# Altium project R100.230.020.000-00 MeasInUI.PrjPcb
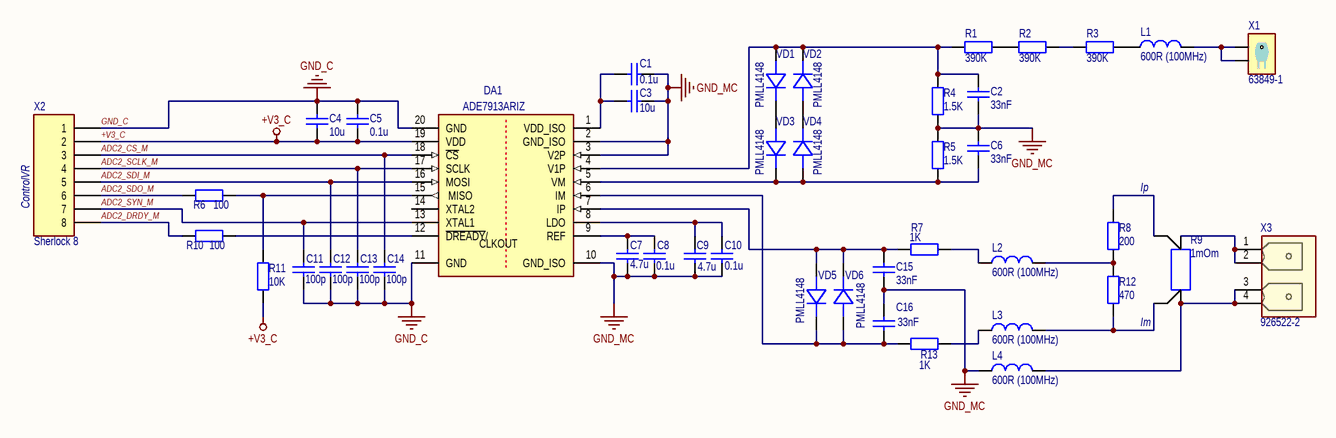
[diagram p0: MeasInUI.SchDoc]
1 sheet, 43 parts. Net scope: global (net labels, ports and power ports of the same name join across sheets).
Board file: R100.230.020.001-00 MeasInUI.PcbDoc

## Sheet MeasInUI.SchDoc
size A4; Organization: OLTEST; SheetNumber: 1; SheetTotal: 1; Название листа: Название листа; Файл: MeasConsumpBoard_v1; Разработчик: Бондарчук С.; Прибор: R100; АМАК.000000.000 Э3: R100.220.030.000 Э3; Дата: 25.12.2017; Формат: A4; WorkSpaceName: R100_Boards_v1

### Parts
C1  0.1u  [SMD_C_0603]
C2  33nF  [SMD_C_0603]
C3  10u  [SMD_C_1206]
C4  10u  [SMD_C_1206]
C5  0.1u  [SMD_C_0603]
C6  33nF  [SMD_C_0603]
C7  4.7u  [SMD_C_0805]
C8  0.1u  [SMD_C_0603]
C9  4.7u  [SMD_C_0805]
C10  0.1u  [SMD_C_0603]
C11  100p  [SMD_C_0603]
C12  100p  [SMD_C_0603]
C13  100p  [SMD_C_0603]
C14  100p  [SMD_C_0603]
C15  33nF  [SMD_C_0603]
C16  33nF  [SMD_C_0603]
DA1  ADE7913ARIZ  [SOIC-20 WidBody (RI-20-1)]
L1  600R (100MHz)  [SMD_L_1206]
L2  600R (100MHz)  [SMD_L_1206]
L3  600R (100MHz)  [SMD_L_1206]
L4  600R (100MHz)  [SMD_L_1206]
R1  390K  [SMD_R_1206]
R2  390K  [SMD_R_1206]
R3  390K  [SMD_R_1206]
R4  1.5K  [SMD_R_1206]
R5  1.5K  [SMD_R_1206]
R6  100  [SMD_R_0603]
R7  1K  [SMD_R_0805]
R8  200  [SMD_R_0805]
R9  1mOm  [WSL3637 1mOm]
R10  100  [SMD_R_0603]
R11  10K  [SMD_R_0603]
R12  470  [SMD_R_0805]
R13  1K  [SMD_R_0805]
VD1  PMLL4148  [SOD80C]
VD2  PMLL4148  [SOD80C]
VD3  PMLL4148  [SOD80C]
VD4  PMLL4148  [SOD80C]
VD5  PMLL4148  [SOD80C]
VD6  PMLL4148  [SOD80C]
X1  63849-1  [63849-1]
X2  Sherlock 8  [35362-0850]
X3  926522-2  [63849-1x2]

### Nets
+V3_C: C4.1 C5.1 DA1.19(VDD) R11.1 X2.2
GND_C: C4.2 C5.2 C11.1 C12.1 C13.1 C14.1 DA1.11(GND) DA1.20(GND) X2.1
GND_MC: C1.1 C2.1 C3.1 C6.2 C7.1 C8.2 C9.1 C10.1 C15.1 C16.2 DA1.2(GND_ISO) DA1.3(V2P) DA1.10(GND_ISO) L4.1 R4.1 R5.2
ADC2_CS_M: C14.2 DA1.18(~{CS}) X2.3
ADC2_DRDY_M: R10.1 X2.8
ADC2_SCLK_M: C13.2 DA1.17(SCLK) X2.4
ADC2_SDI_M: C12.2 DA1.16(MOSI) X2.5
ADC2_SDO_M: R6.1 X2.6
ADC2_SYN_M: C11.2 DA1.13(XTAL1) X2.7
NetC1_2: C1.2 C3.2 DA1.1(VDD_ISO)
NetC2_2: C2.2 DA1.4(V1P) R1.1 R4.2 VD1.1(ANODE) VD2.2(CATHODE)
NetC6_1: C6.1 DA1.5(VM) R5.1 VD3.2(CATHODE) VD4.1(ANODE)
NetC7_2: C7.2 C8.1 DA1.9(REF)
NetC9_2: C9.2 C10.2 DA1.8(LDO)
NetC15_2: C15.2 DA1.7(IP) R7.1 VD5.1(ANODE) VD6.2(CATHODE)
NetC16_1: C16.1 DA1.6(IM) R13.1 VD5.2(CATHODE) VD6.1(ANODE)
NetDA1_12: DA1.12(~{DREADY}/) R10.2
NetDA1_15: DA1.15(MISO) R6.2 R11.2
NetL1_1: L1.1 R3.2
NetL1_2: L1.2 X1.1 X1.2
NetL2_1: L2.1 R7.2
NetL2_2: L2.2 R8.1 R12.2
NetL3_1: L3.1 R13.2
NetL3_2: L3.2 R9.2(E1) R12.1
NetL4_2: L4.2 R9.1(I1) X3.3 X3.4
NetR1_2: R1.2 R2.1
NetR2_2: R2.2 R3.1
NetR8_2: R8.2 R9.4(E2)
NetR9_3: R9.3(I2) X3.1 X3.2
NetVD1_2: VD1.2(CATHODE) VD3.1(ANODE)
NetVD2_1: VD2.1(ANODE) VD4.2(CATHODE)

Not connected (* = marked no-connect by the designer): DA1 14(XTAL2)

### Notes on the sheet
- (near X2) ControlVR
- Ip
- Im
- Разработчик:
- Формат:
- Rev.:
- Лист
- Дата:
- Листов
- WorkSpace:
- Дата изм.:
- (in symbol ADE7913ARIZ) CLKOUT

### Library data of the parts
C1 C5 C8 C10 = C0603 0.1u 50V 10%: SMD C 0603 MURATA 50V 10% X7R; PartNumber: GRM188R71H104K; Manufacturer: MURATA; Value: 0.1u
C2 C6 C15 C16 = C0603 33nF 50V 10%: SMD C 0603 MURATA 50V 10% X7R; PartNumber: GCM188R71H333KA55#; Manufacturer: MURATA; Value: 33nF
C3 C4 = C1206 10u 25V 20%: SMD C 1206 MURATA 25V 20% X5R; PartNumber: GRM31MR61E106M; Manufacturer: MURATA; Value: 10u
C7 C9 = C0805 4.7u 25V 20%  X5R: SMD C 0805 MURATA 50V 5% NP0; PartNumber: GRM21BR61E475M; Manufacturer: MURATA; Value: 4.7u
C11-C14 = C0603 100p 100V 5%: SMD C 0603 MURATA 100V 5% NP0; PartNumber: GRM1885C2A101JA01; Manufacturer: MURATA; Value: 100p
DA1 = ADE7913ARIZ: Isolated, Sigma-Delta ADC with SPI; Manufacturer: Analog Device; PartNumber: ADE7913ARIZ
L1-L4 = BLM31PG601SN1: 600R 1.5A (100MHz); Manufacturer: TDK; PartNumber: BLM31PG601SN1; Value: 600R 1.5A (100MHz)
R1-R3 = R1206 390K 1%: SMD R 1206 VISHAY 0.25W 200V 1% 100ppm; PartNumber: CRCW1206390KFK; Manufacturer: VISHAY; Value: 390K
R4 R5 = R1206 1.5K 1%: SMD R 1206 VISHAY 0.25W 200V 1% 100ppm; PartNumber: CRCW12061K50FK; Manufacturer: VISHAY; Value: 1.5K
R6 R10 = R0603 100 1%: SMD R 0603 VISHAY 0.1W 75V 1% 100ppm; PartNumber: CRCW0603100RFK; Manufacturer: VISHAY; Value: 100
R7 R13 = R0805 1K 1%: SMD R 0805 VISHAY 0.125W 150V 1% 100ppm; PartNumber: CRCW08051K00FK; Manufacturer: VISHAY; Value: 1K
R8 = R0805 200 1%: SMD R 0805 VISHAY 0.125W 150V 1% 100ppm; PartNumber: CRCW0805200RFK; Manufacturer: VISHAY; Value: 200
R9 = WSL3637 1mOm 3W: WSL3637 1mOm 3W 1% 75ppm; PartNumber: WSL36371L000F; Manufacturer: Vishay; Value: 1mOm
R11 = R0603 10К 1%: SMD R 0603 VISHAY 0.1W 75V 1% 100ppm; PartNumber: CRCW060310K0FK; Manufacturer: VISHAY; Value: 10K
R12 = R0805 470 1%: SMD R 0805 VISHAY 0.125W 150V 1% 100ppm; PartNumber: CRCW0805470RFK; Manufacturer: VISHAY; Value: 470
VD1-VD6 = PMLL4148: If=0.2A, Vf=1V Vrrm=100V Diode (SOD80C); Manufacturer: NXP Semiconductors; PartNumber: PMLL4148
X1 = 63849-1: PCB, 6.3х0.8, hole; Manufacturer: TE Connectivity; PartNumber: 63849-1
X2 = 35362-0850: Sherlock 8 Side, 2A 125V 2mm; Manufacturer: MOLEX; PartNumber: 35362-0850
X3 = 63849-1x2: DUAL TAB FASTON PCB (926522-2); Manufacturer: TE Connectivity; PartNumber: 63849-1x2; Value: 926522-2